# Altium schematic sheet Sensor.SchDoc
size A4; SheetNumber: 1; SheetTotal: 2
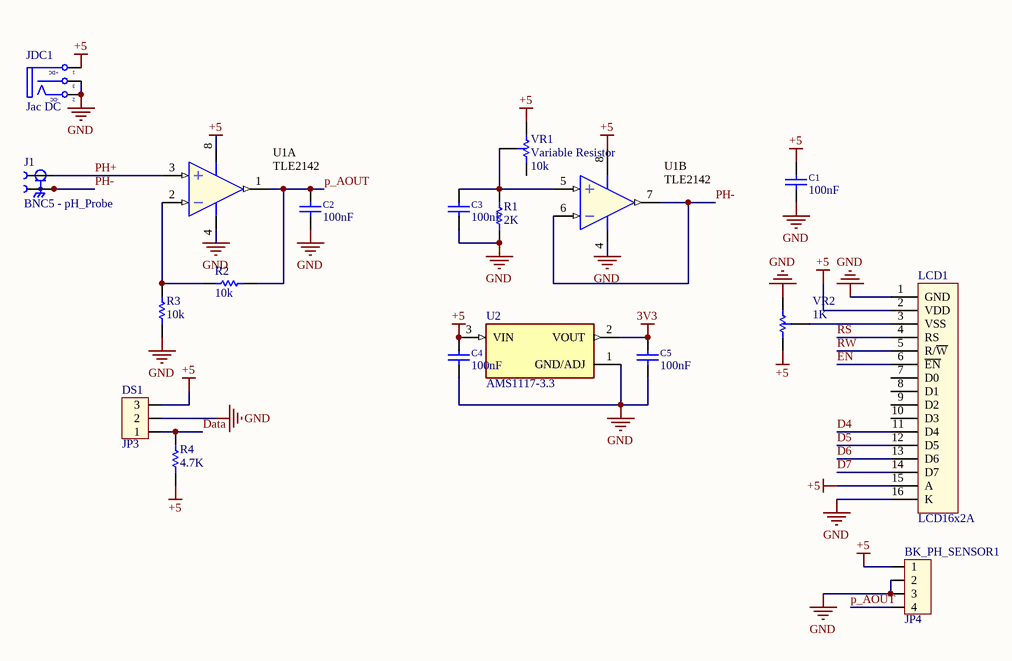
[diagram p0: Sensor.SchDoc]

## Parts
BK_PH_SENSOR1  JP4  [CON4]
C1  100nF  [C2012-0805]
C2  100nF  [C2012-0805]
C3  100nF  [C2012-0805]
C4  100nF  [C2012-0805]
C5  100nF  [C2012-0805]
DS1  JP3  [CON3]
J1  BNC5 - pH_Probe  [SAMTEC_BNC5-J-P-GN-RA-BH2D]
JDC1  Jac DC  [DC-IN]
LCD1  LCD16x2A  [LCD16X2]
R1  value 2K  [R-0805]  (hidden comment: RESISTOR)
R2  value 10k  [R-0805]  (hidden comment: RESISTOR)
R3  value 10k  [R-0805]  (hidden comment: RESISTOR)
R4  value 4.7K  [R-0805]  (hidden comment: RESISTOR)
U1  TLE2142  [SOIC8]  (parts A,B of 2)
U2  AMS1117-3.3  [SOT229P700X180-4N]
VR1  Variable Resistor  value 10k  [VRes-R]
VR2  value 1K  [VRes-C]

## Nets
3V3: C5.2 U2.2(VOUT)
+5: BK_PH_SENSOR1.1 C1.2 C4.2 DS1.3 JDC1.1(T) LCD1.2(VDD) LCD1.15(A) R4.1 U1.8(V+) U2.3(VIN) VR1.1 VR2.1
GND: BK_PH_SENSOR1.2 BK_PH_SENSOR1.3 C1.1 C2.1 C3.1 C4.1 C5.1 DS1.2 JDC1.2(TN) JDC1.3(S) LCD1.1(GND) LCD1.16(K) R1.1 R3.1 U1.4(GND) U2.1(GND/ADJ) VR2.3
D4: LCD1.11(D4)
D5: LCD1.12(D5)
D6: LCD1.13(D6)
D7: LCD1.14(D7)
Data: DS1.1 R4.2
EN: LCD1.6(~{EN})
p_AOUT: BK_PH_SENSOR1.4 C2.2 R2.2 U1.1(OUT)
PH+: J1.1 U1.3(IN+)
PH-: J1.S_1 J1.S_2 J1.S_3 J1.S_4 U1.6(IN-) U1.7(OUT)
RS: LCD1.4(RS)
RW: LCD1.5(R/~{W})
NetC3_2: C3.2 R1.2 U1.5(IN+) VR1.2
NetLCD1_3: LCD1.3(VSS) VR2.2
NetR2_1: R2.1 R3.2 U1.2(IN-)

Not connected (* = marked no-connect by the designer): LCD1 7(D0) 8(D1) 9(D2) 10(D3); VR1 3

## Notes on the sheet
- (in symbol DCIN) +DC; -DC

## Library data of the parts
BK_PH_SENSOR1 = Con4: Connector 4; Value: Connector 4
C1-C5 = Capacitor: AEMS Code: 2100341; Vendor: Digikey; Volt: 16V; Published: 13-April-2009; Publisher: Hoang Nguyen; ComponentLink1Description: Digikey Part Link; ComponentLink2Description: Open Datasheet; ComponentLink2URL: H:\LIBRARY\LIBRARY.Datasheet\; Value: 100nF
DS1 = Con3: Connector 3; Value: Connector 3
J1 = BNC5-J-P-GN-RA-BH2D: BNC Connector Jack, Female Socket 50Ohm Panel Mount, Through Hole, Right Angle Solder; MF: Samtec; Value: *; SnapEDA_Link: https://www.snapeda.com/parts/BNC5-J-P-GN-RA-BH2D/Samtec%20Inc./view-part/933377/?ref=snap; MP: BNC5-J-P-GN-RA-BH2D; Check_prices: https://www.snapeda.com/parts/BNC5-J-P-GN-RA-BH2D/Samtec%20Inc./view-part/933377/?ref=eda; Purchase-URL: https://pricing.snapeda.com/search/part/BNC5-J-P-GN-RA-BH2D/?ref=eda; Availability: In Stock; Price: None; Package: None
JDC1 = DCIN: Jac DC input; Value: Jac DC
LCD1 = LCD16x2: LCD dipslay 16 char, 2 line; Value: LCD16x2A
U1 = LM2904: Low-Power Dual Operational Amplifier; Published: 15-Apr-2002; LatestRevisionDate: 06-Jun-2005; LatestRevisionNote: Stylized 3D Model Added.; DatasheetVersion: Sep-1999; PackageVersion: Sep-1997; PackageReference: N08E; Publisher: Altium Limited; PackageDescription: DIP; 8 Leads; Row Spacing 7.62 mm; Pitch 2.54 mm; ComponentLink1Description: Manufacturer Link; ComponentLink1URL: http://www.national.com/; ComponentLink2Description: Datasheet; ComponentLink2URL: http://www.national.com/ds.cgi/LM/LM158.pdf; ComponentLink3Description: URL Link1; ComponentLink3URL: http://www.national.com/pf/LM/LM358.html
U2 = AMS1117-3.3: Sot223/Pkg 1-Amp 3.3-Volt Low Drop Out Voltage Regulatator; MF: Advanced Monolithic Systems; Package: SOT-223 Seeed Technology; Value: *; Check_prices: https://www.snapeda.com/parts/AMS1117-3.3/Advanced+Monolithic+Systems/view-part/?ref=eda; Price: None; Availability: Not in stock; MP: AMS1117-3.3; SnapEDA_Link: https://www.snapeda.com/parts/AMS1117-3.3/Advanced+Monolithic+Systems/view-part/?ref=snap
VR2 = Variable Resistor: Published: 8-Jun-2000; LatestRevisionDate: 17-Jul-2002; LatestRevisionNote: Re-released for DXP Platform.; PackageReference: AXIAL-0.3; Publisher: Altium Limited
R1-R4 = RESISTOR: Published: 8-Jun-2000; LatestRevisionDate: 17-Jul-2002; LatestRevisionNote: Re-released for DXP Platform.; PackageReference: AXIAL-0.3; Publisher: Altium Limited
VR1 = Variable Resistor: Published: 8-Jun-2000; LatestRevisionDate: 17-Jul-2002; LatestRevisionNote: Re-released for DXP Platform.; PackageReference: AXIAL-0.3; Publisher: Altium Limited